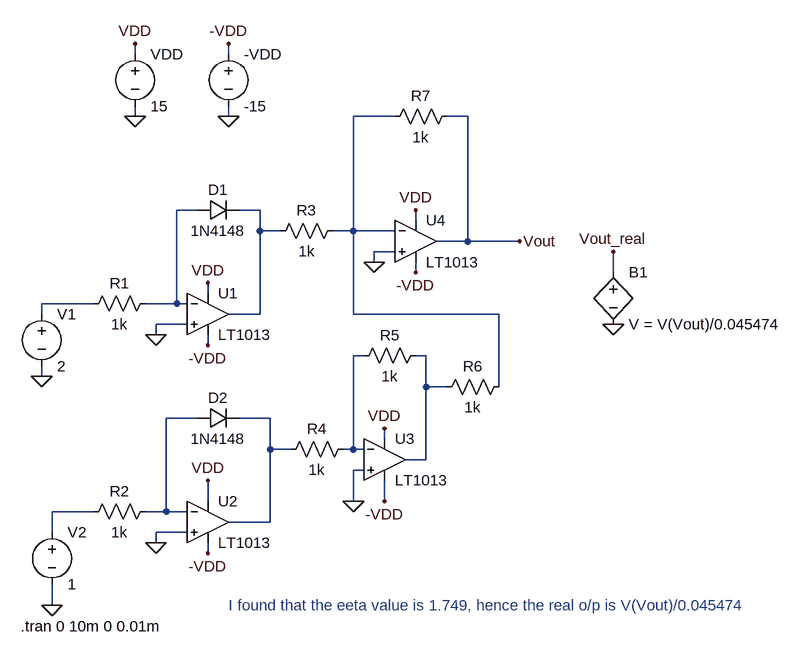
[diagram p0: schematic Logarithm_Circuit.asc]
Logarithm_Circuit.asc, the LTspice schematic file:
Version 4.1
SHEET 1 1476 864
WIRE -176 -32 -176 -48
WIRE -32 -32 -32 -48
WIRE -176 64 -176 48
WIRE -32 64 -32 48
WIRE 224 64 160 64
WIRE 336 64 304 64
WIRE -80 208 -112 208
WIRE 16 208 -16 208
WIRE 256 224 256 208
WIRE 16 240 16 208
WIRE 48 240 16 240
WIRE 160 240 160 64
WIRE 160 240 128 240
WIRE 224 240 160 240
WIRE 336 256 336 64
WIRE 336 256 288 256
WIRE 416 256 336 256
WIRE 224 272 192 272
WIRE 192 288 192 272
WIRE 256 304 256 288
WIRE 560 304 560 272
WIRE -64 336 -64 320
WIRE -240 352 -320 352
WIRE -112 352 -112 208
WIRE -112 352 -160 352
WIRE -96 352 -112 352
WIRE -320 368 -320 352
WIRE 16 368 16 240
WIRE 16 368 -32 368
WIRE 160 368 160 240
WIRE 384 368 160 368
WIRE -96 384 -144 384
WIRE -144 400 -144 384
WIRE -64 416 -64 400
WIRE 176 432 160 432
WIRE 272 432 256 432
WIRE -320 464 -320 448
WIRE 272 480 272 432
WIRE 304 480 272 480
WIRE 384 480 384 368
WIRE -80 528 -128 528
WIRE 32 528 -16 528
WIRE 208 560 208 544
WIRE 32 576 32 528
WIRE 64 576 32 576
WIRE 160 576 160 432
WIRE 160 576 144 576
WIRE 176 576 160 576
WIRE 272 592 272 480
WIRE 272 592 240 592
WIRE 176 608 160 608
WIRE -64 656 -64 624
WIRE 160 656 160 608
WIRE 208 656 208 624
WIRE -240 672 -304 672
WIRE -128 672 -128 528
WIRE -128 672 -160 672
WIRE -96 672 -128 672
WIRE 32 688 32 576
WIRE 32 688 -32 688
WIRE -304 704 -304 672
WIRE -96 704 -144 704
WIRE -144 720 -144 704
WIRE -64 736 -64 720
WIRE -304 816 -304 784
FLAG -176 64 0
FLAG -32 64 0
FLAG -32 -48 -VDD
FLAG -176 -48 VDD
FLAG -144 400 0
FLAG -144 720 0
FLAG -64 320 VDD
FLAG -64 416 -VDD
FLAG -64 624 VDD
FLAG -64 736 -VDD
FLAG -320 464 0
FLAG -304 816 0
FLAG 208 544 VDD
FLAG 208 656 -VDD
FLAG 160 656 0
FLAG 192 288 0
FLAG 256 208 VDD
FLAG 256 304 -VDD
FLAG 416 256 Vout
FLAG 560 384 0
FLAG 560 272 Vout_real
SYMBOL voltage -176 -48 R0
SYMATTR InstName VDD
SYMATTR Value 15
SYMBOL voltage -32 -48 R0
SYMATTR InstName -VDD
SYMATTR Value -15
SYMBOL voltage -320 352 R0
WINDOW 123 0 0 Left 0
WINDOW 39 0 0 Left 0
SYMATTR InstName V1
SYMATTR Value 2
SYMBOL voltage -304 688 R0
WINDOW 123 0 0 Left 0
WINDOW 39 0 0 Left 0
SYMATTR InstName V2
SYMATTR Value 1
SYMBOL res -144 336 R90
WINDOW 0 0 56 VBottom 2
WINDOW 3 32 56 VTop 2
SYMATTR InstName R1
SYMATTR Value 1k
SYMBOL res -144 656 R90
WINDOW 0 0 56 VBottom 2
WINDOW 3 32 56 VTop 2
SYMATTR InstName R2
SYMATTR Value 1k
SYMBOL OpAmps\\LT1013 -64 304 R0
SYMATTR InstName U1
SYMBOL OpAmps\\LT1013 -64 624 R0
SYMATTR InstName U2
SYMBOL diode -80 224 R270
WINDOW 0 32 32 VTop 2
WINDOW 3 0 32 VBottom 2
SYMATTR InstName D1
SYMATTR Value 1N4148
SYMBOL diode -80 544 R270
WINDOW 0 32 32 VTop 2
WINDOW 3 0 32 VBottom 2
SYMATTR InstName D2
SYMATTR Value 1N4148
SYMBOL res 144 224 R90
WINDOW 0 0 56 VBottom 2
WINDOW 3 32 56 VTop 2
SYMATTR InstName R3
SYMATTR Value 1k
SYMBOL res 160 560 R90
WINDOW 0 0 56 VBottom 2
WINDOW 3 32 56 VTop 2
SYMATTR InstName R4
SYMATTR Value 1k
SYMBOL OpAmps\\LT1013 208 528 R0
SYMATTR InstName U3
SYMBOL res 272 416 R90
WINDOW 0 0 56 VBottom 2
WINDOW 3 32 56 VTop 2
SYMATTR InstName R5
SYMATTR Value 1k
SYMBOL res 400 464 R90
WINDOW 0 0 56 VBottom 2
WINDOW 3 32 56 VTop 2
SYMATTR InstName R6
SYMATTR Value 1k
SYMBOL OpAmps\\LT1013 256 192 R0
SYMATTR InstName U4
SYMBOL res 320 48 R90
WINDOW 0 0 56 VBottom 2
WINDOW 3 32 56 VTop 2
SYMATTR InstName R7
SYMATTR Value 1k
SYMBOL bv 560 288 R0
SYMATTR InstName B1
SYMATTR Value V = V(Vout)/0.045474
TEXT -352 848 Left 2 !.tran 0 10m 0 0.01m
TEXT -32 816 Left 2 ;I found that the eeta value is 1.749, hence the real o/p is V(Vout)/0.045474

The netlist it stands for:
* Logarithm_Circuit.asc
VDD VDD 0 15
V§-VDD -VDD 0 -15
V1 N004 0 2
V2 N009 0 1
R1 N002 N004 1k
R2 N007 N009 1k
X§U1 0 N002 VDD -VDD N003 LT1013  ; pins In+ In- V+ V- OUT
X§U2 0 N007 VDD -VDD N008 LT1013  ; pins In+ In- V+ V- OUT
D1 N002 N003 1N4148
D2 N007 N008 1N4148
R3 N001 N003 1k
R4 N005 N008 1k
X§U3 0 N005 VDD -VDD N006 LT1013  ; pins In+ In- V+ V- OUT
R5 N006 N005 1k
R6 N001 N006 1k
X§U4 0 N001 VDD -VDD Vout LT1013  ; pins In+ In- V+ V- OUT
R7 Vout N001 1k
B1 Vout_real 0 V = V(Vout)/0.045474
.model D D
.lib standard.dio
.tran 0 10m 0 0.01m
* I found that the eeta value is 1.749, hence the real o/p is V(Vout)/0.045474
.lib LTC.lib
.backanno
.end